# EAGLE design Hand (EAGLE 7.2.0)
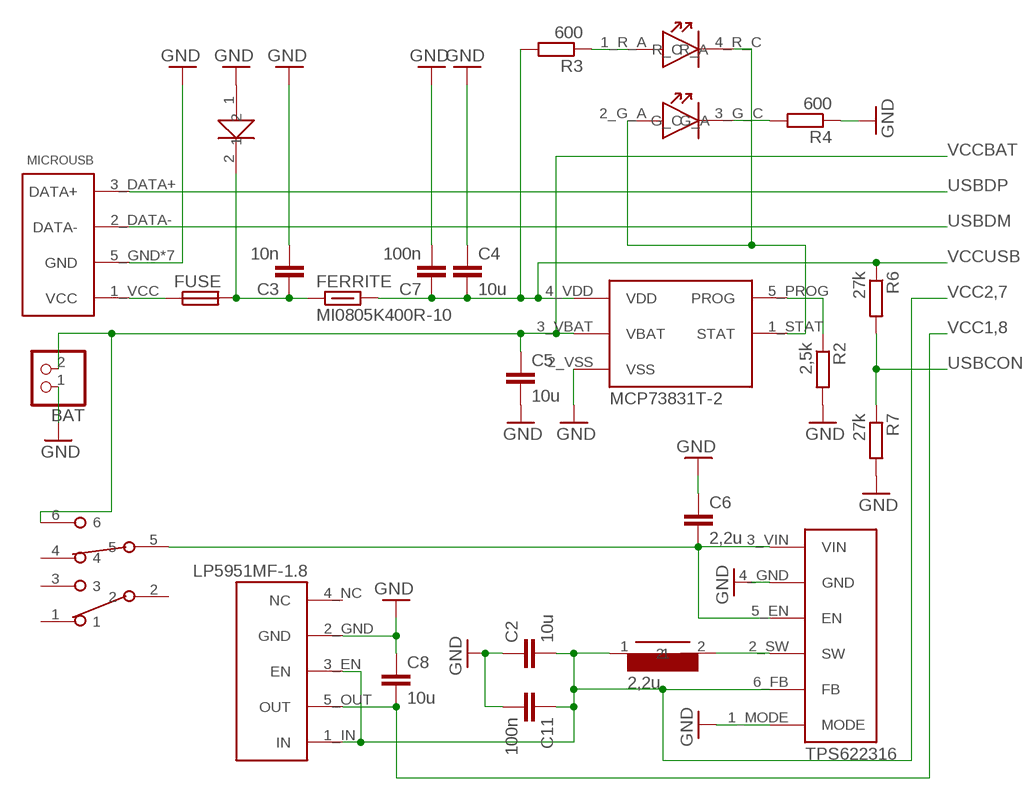
[diagram p0: schematic, sheet 1, part 1 of 2]
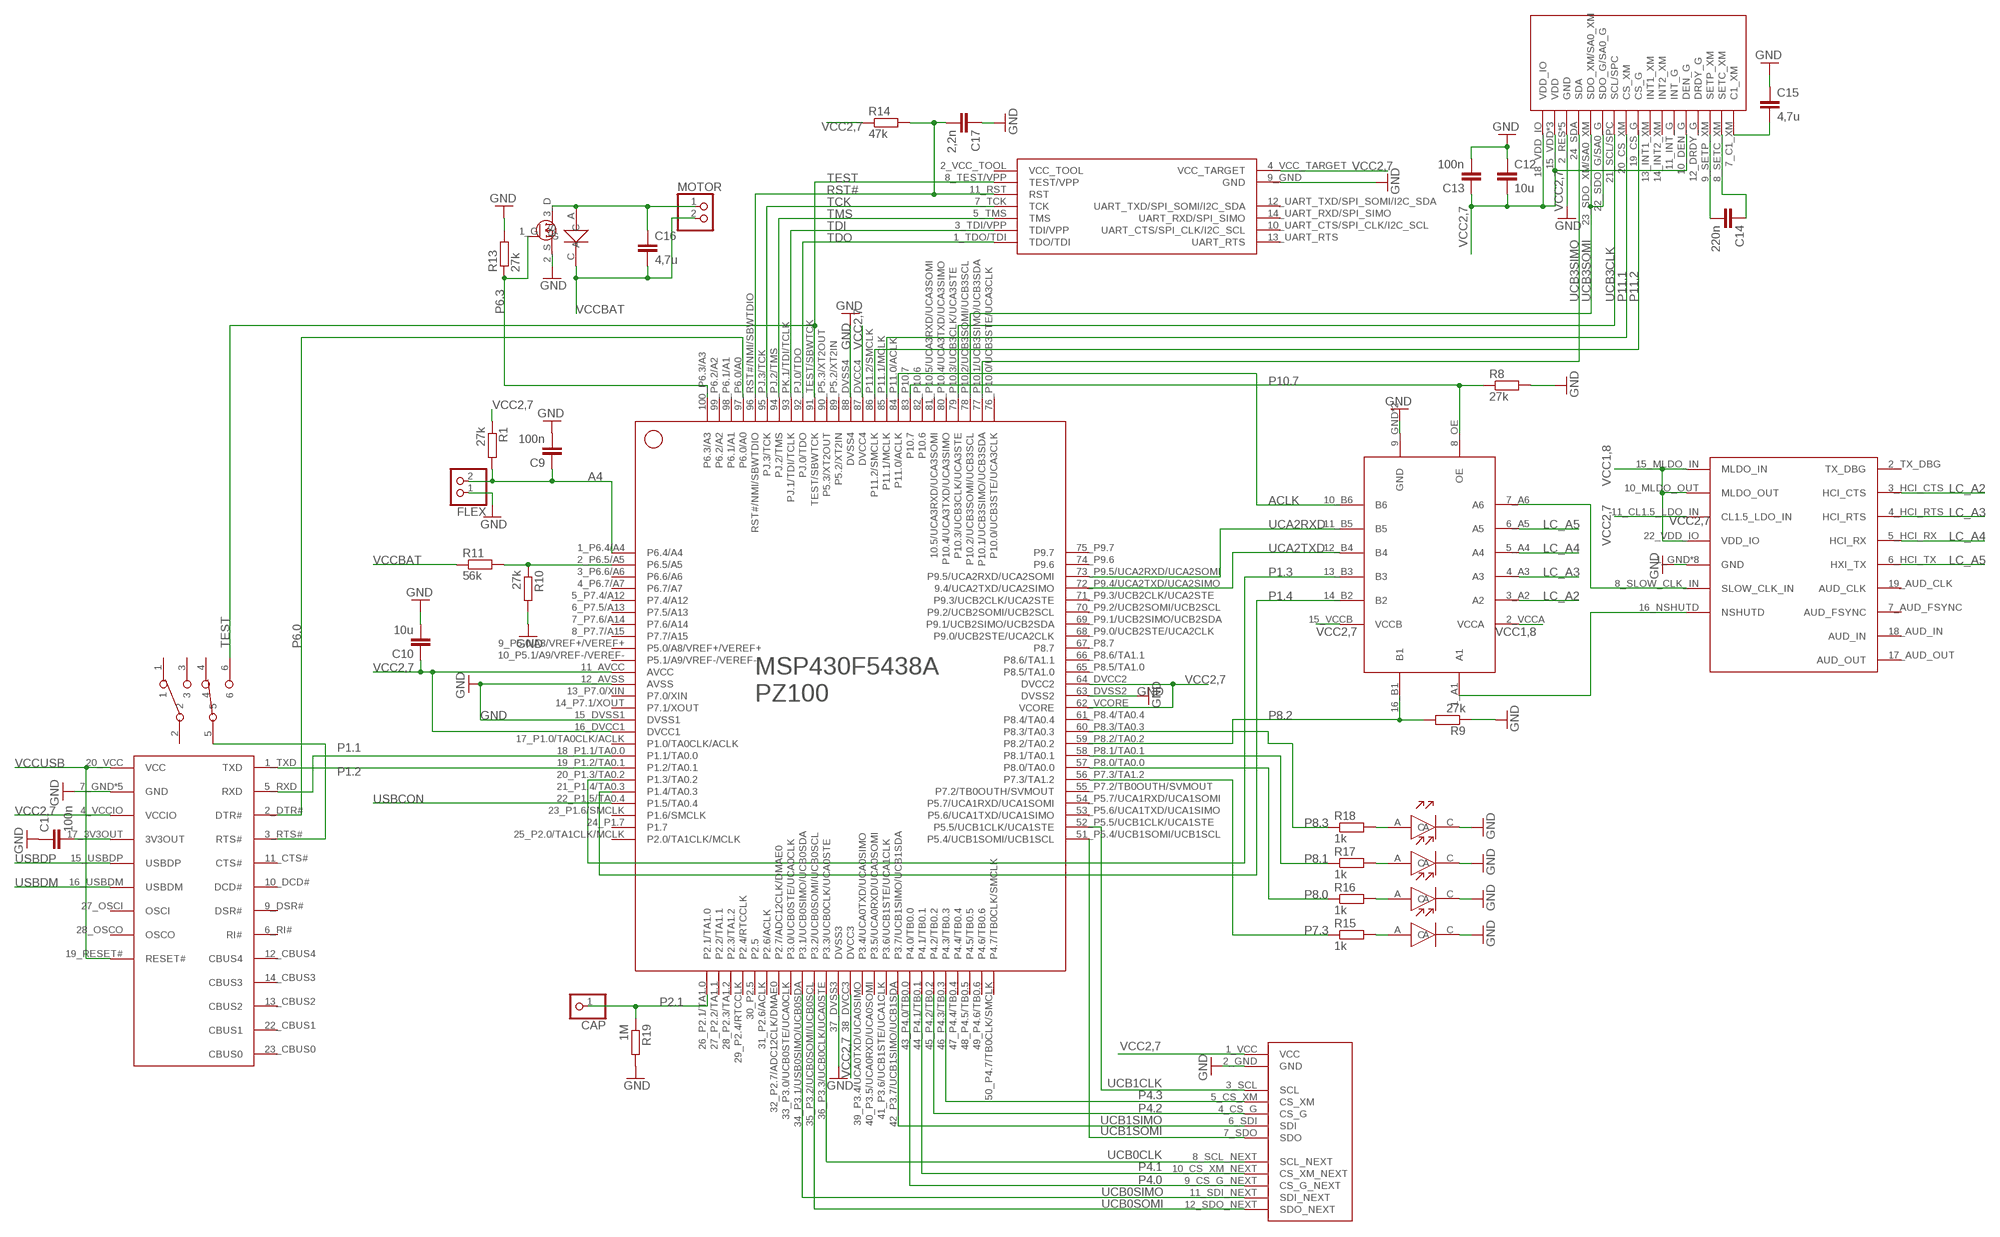
[diagram p1: schematic, sheet 1, part 2 of 2]

## Parts
BAT  PINHD-1X2  [1X02]
C1  100n  C-EUC0402  [C0402]
C2  10u  C-EUC0805  [C0805]
C3  10n  C-EUC0402  [C0402]
C4  10u  C-EUC0805  [C0805]
C5  10u  C-EUC0805  [C0805]
C6  2,2u  C-EUC0805  [C0805]
C7  100n  C-EUC0402  [C0402]
C8  10u  C-EUC0805  [C0805]
C9  100n  C-EUC0402  [C0402]
C10  10u  C-EUC0805  [C0805]
C11  100n  C-EUC0402  [C0402]
C12  10u  C-EUC0805  [C0805]
C13  100n  C-EUC0402  [C0402]
C14  220n  C-EUC0402  [C0402]
C15  4,7u  C-EUC0805  [C0805]
C16  4,7u  C-EUC0805  [C0805]
C17  2,2n  C-EUC0603  [C0603]
CAP  PINHD-1X1  [1X01]
FERRITE  MI0805K400R-10  FERRITER0603  [R0603]
FLEX  PINHD-1X2  [1X02]
FUSE  SICHERUNG  [C0603]
IMU_OUT  IMU-BUCHSE-OUT  [OUT]
LP5951MF-1.8  VDDIOREGLER-SC70  [SC70]
MCP73831T-2  MCP73831/2-SOT-23-5  [SOT-23-5]
MICROUSB  MICRO_USB-PCB  [PCB]
MOTOR  PINHD-1X2  [1X02]
R1  27k  R-EU_R0402  [R0402]
R2  2,5k  R-EU_R0402  [R0402]
R3  600  R-EU_R0402  [R0402]
R4  600  R-EU_R0402  [R0402]
R6  27k  R-EU_R0402  [R0402]
R7  27k  R-EU_R0402  [R0402]
R8  27k  R-EU_R0402  [R0402]
R9  27k  R-EU_R0402  [R0402]
R10  27k  R-EU_R0402  [R0402]
R11  56k  R-EU_R0402  [R0402]
R13  27k  R-EU_R0402  [R0402]
R14  47k  R-EU_R0402  [R0402]
R15  1k  R-EU_R0402  [R0402]
R16  1k  R-EU_R0402  [R0402]
R17  1k  R-EU_R0402  [R0402]
R18  1k  R-EU_R0402  [R0402]
R19  1M  R-EU_R0402  [R0402]
SPULE  2,2u  SPULE  [C0603]
TPS622316  SCHALTREGLER-R-PUSON-N6  [R-PUSON-N6]
U$1  FT232R-SSOP-28  [SSOP-28]
U$2  LSM9DS0-LGA-24  [LGA-24]
U$4  PAN132X  [BOARD]
U$5  MSP430BT5190-PZ100  [PZ100]
U$7  LED-PCB  [PCB]
U$8  LADE-MOSFET-SOC-23  [SOT-23]
U$9  FREILAUFDIODE  [FEILAUFDIODE]
U$11  ANSCHALTER-PACKAGE  [PACKAGE]
U$12  ANSCHALTER-PACKAGE  [PACKAGE]
U$13  LOGIKPEGELWANDLER-6CH  [R-PVQFN-N16]
U$15  LEDMINI  [LEDMINI]
U$16  JTAG-BUCHSE  [BUCHSE]
U$17  LEDMINI  [LEDMINI]
U$18  LEDMINI  [LEDMINI]
U$19  LEDMINI  [LEDMINI]
U$20  DIODE-C0603  [C0603]

## Nets
A4: C9.1 FLEX.2 R1.2 U$5.1_P6.4/A4(P6.4/A4)
ACLK: U$5.84_P11.0/ACLK(P11.0/ACLK) U$13.10_B6(B6)
GND: BAT.1 C1.1 C2.1 C3.2 C4.1 C5.2 C6.1 C7.2 C8.1 C9.2 C10.2 C11.2 C12.1 C13.2 C15.1 C17.1 FLEX.1 IMU_OUT.2_GND(GND) LP5951MF-1.8.2_GND(GND) MCP73831T-2.2_VSS(VSS) MICROUSB.5_GND(GND) MICROUSB.EP_1(GND) MICROUSB.EP_2(GND) MICROUSB.EP_3(GND) MICROUSB.EP_4(GND) MICROUSB.P$1(GND) MICROUSB.P$2(GND) R2.2 R4.1 R7.2 R8.2 R9.1 R10.2 R13.2 R19.2 TPS622316.1_MODE(MODE) TPS622316.4_GND(GND) U$1.7_GND(GND) U$1.18_GND(GND) U$1.21_GND(GND) U$1.25_AGND(GND) U$1.26_TEST(GND) U$2.2_RES(GND) U$2.3_RES(GND) U$2.4_RES(GND) U$2.5_GND(GND) U$2.6_GND(GND) U$4.1_GND(GND) U$4.12_GND(GND) U$4.14_GND(GND) U$4.20_GND(GND) U$4.A_GND(GND) U$4.B_GND(GND) U$4.C_GND(GND) U$4.D_GND(GND) U$5.12_AVSS(AVSS) U$5.15_DVSS1(DVSS1) U$5.37_DVSS3(DVSS3) U$5.63_DVSS2(DVSS2) U$5.88_DVSS4(DVSS4) U$8.2_S(S) U$13.9_GND(GND) U$13.PAD(GND) U$15.C U$16.9_GND(GND) U$17.C U$18.C U$19.C U$20.1
LC_A2: U$4.3_HCI_CTS(HCI_CTS) U$13.3_A2(A2)
LC_A3: U$4.4_HCI_RTS(HCI_RTS) U$13.4_A3(A3)
LC_A4: U$4.5_HCI_RX(HCI_RX) U$13.5_A4(A4)
LC_A5: U$4.6_HCI_TX(HXI_TX) U$13.6_A5(A5)
N$1: U$1.3_RTS#(RTS#) U$11.5
N$2: C3.1 FERRITE.1 FUSE.2 U$20.2
N$3: C1.2 U$1.17_3V3OUT(3V3OUT)
N$4: R10.1 R11.2 U$5.2_P6.5/A5(P6.5/A5)
N$5: MCP73831T-2.5_PROG(PROG) R2.1
N$6: R3.1 U$7.1_R_A(R_A)
N$7: MCP73831T-2.1_STAT(STAT) U$7.2_G_A(G_A) U$7.4_R_C(R_C)
N$8: U$4.8_SLOW_CLK_IN(SLOW_CLK_IN) U$13.7_A6(A6)
N$9: R4.2 U$7.3_G_C(G_C)
N$10: SPULE.2 TPS622316.2_SW(SW)
N$19: C6.2 TPS622316.3_VIN(VIN) TPS622316.5_EN(EN) U$12.5
N$25: U$4.16_NSHUTD(NSHUTD) U$13.1_A1(A1)
N$37: C16.1 MOTOR.1 U$8.3_D(D) U$9.A
N$40: R18.2 U$15.A
N$46: C15.2 U$2.7_C1_XM(C1_XM)
N$47: C14.1 U$2.8_SETC_XM(SETC_XM)
N$48: C14.2 U$2.9_SETP_XM(SETP_XM)
N$50: R17.2 U$17.A
N$52: R16.2 U$18.A
N$53: R15.2 U$19.A
N$60: FUSE.1 MICROUSB.1_VCC(VCC)
P1.1: U$1.5_RXD(RXD) U$5.18_P1.1/TA0.0(P1.1/TA0.0)
P1.2: U$1.1_TXD(TXD) U$5.19_P1.2/TA0.1(P1.2/TA0.1)
P1.3: U$5.20_P1.3/TA0.2(P1.3/TA0.2) U$13.13_B3(B3)
P1.4: U$5.21_P1.4/TA0.3(P1.4/TA0.3) U$13.14_B2(B2)
P2.1: CAP.1 R19.1 U$5.26_P2.1/TA1.0(P2.1/TA1.0)
P4.0: IMU_OUT.9_CS_G_NEXT(CS_G_NEXT) U$5.43_P4.0/TB0.0(P4.0/TB0.0)
P4.1: IMU_OUT.10_CS_XM_NEXT(CS_XM_NEXT) U$5.44_P4.1/TB0.1(P4.1/TB0.1)
P4.2: IMU_OUT.4_CS_G(CS_G) U$5.45_P4.2/TB0.2(P4.2/TB0.2)
P4.3: IMU_OUT.5_CS_XM(CS_XM) U$5.46_P4.3/TB0.3(P4.3/TB0.3)
P6.0: U$1.2_DTR#(DTR#) U$5.97_P6.0/A0(P6.0/A0)
P6.3: R13.1 U$5.100_P6.3/A3(P6.3/A3) U$8.1_G(G)
P7.3: R15.1 U$5.56_P7.3/TA1.2(P7.3/TA1.2)
P8.0: R16.1 U$5.57_P8.0/TA0.0(P8.0/TA0.0)
P8.1: R17.1 U$5.58_P8.1/TA0.1(P8.1/TA0.1)
P8.2: R9.2 U$5.59_P8.2/TA0.2(P8.2/TA0.2) U$13.16_B1(B1)
P8.3: R18.1 U$5.60_P8.3/TA0.3(P8.3/TA0.3)
P10.7: R8.1 U$5.83_P10.7(P10.7) U$13.8_OE(OE)
P11.1: U$2.20_CS_XM(CS_XM) U$5.85_P11.1/MCLK(P11.1/MCLK)
P11.2: U$2.19_CS_G(CS_G) U$5.86_P11.2/SMCLK(P11.2/SMCLK)
RST#: C17.2 R14.2 U$5.96_RST#/NMI/SBWTDIO(RST#/NMI/SBWTDIO) U$16.11_RST(RST)
TCK: U$5.95_PJ.3/TCK(PJ.3/TCK) U$16.7_TCK(TCK)
TDI: U$5.93_PK.1/TDI/TCLK(PJ.1/TDI/TCLK) U$16.3_TDI/VPP(TDI/VPP)
TDO: U$5.92_PJ.0/TDO(PJ.0/TDO) U$16.1_TDO/TDI(TDO/TDI)
TEST: U$5.91_TEST/SBWTCK(TEST/SBWTCK) U$11.6 U$16.8_TEST/VPP(TEST/VPP)
TMS: U$5.94_PJ.2/TMS(PJ.2/TMS) U$16.5_TMS(TMS)
UCA2RXD: U$5.73_P9.5/UCA2RXD/UCA2SOMI(P9.5/UCA2RXD/UCA2SOMI) U$13.11_B5(B5)
UCA2TXD: U$5.72_P9.4/UCA2TXD/UCA2SIMO(9.4/UCA2TXD/UCA2SIMO) U$13.12_B4(B4)
UCB0CLK: IMU_OUT.8_SCL_NEXT(SCL_NEXT) U$5.36_P3.3/UCB0CLK/UCA0STE(P3.3/UCB0CLK/UCA0STE)
UCB0SIMO: IMU_OUT.11_SDI_NEXT(SDI_NEXT) U$5.34_P3.1/USB0SIMO/UCB0SDA(P3.1/UCB0SIMO/UCB0SDA)
UCB0SOMI: IMU_OUT.12_SDO_NEXT(SDO_NEXT) U$5.35_P3.2/UCB0SOMI/UCB0SCL(P3.2/UCB0SOMI/UCB0SCL)
UCB1CLK: IMU_OUT.3_SCL(SCL) U$5.52_P5.5/UCB1CLK/UCA1STE(P5.5/UCB1CLK/UCA1STE)
UCB1SIMO: IMU_OUT.6_SDI(SDI) U$5.42_P3.7/UCB1SIMO/UCB1SDA(P3.7/UCB1SIMO/UCB1SDA)
UCB1SOMI: IMU_OUT.7_SDO(SDO) U$5.51_P5.4/UCB1SOMI/UCB1SCL(P5.4/UCB1SOMI/UCB1SCL)
UCB3CLK: U$2.21_SCL/SPC(SCL/SPC) U$5.79_P10.3/UCB3CLK/UCA3STE(P10.3/UCB3CLK/UCA3STE)
UCB3SIMO: U$2.24_SDA(SDA) U$5.77_P10.1/UCB3SIMO/UCB3SDA(P10.1/UCB3SIMO/UCB3SDA)
UCB3SOMI: U$2.22_SDO_G/SA0_G(SDO_G/SA0_G) U$2.23_SDO_XM/SA0_XM(SDO_XM/SA0_XM) U$5.78_P10.2/UCB3SOMI/UCB3SCL(P10.2/UCB3SOMI/UCB3SCL)
USBCON: R6.2 R7.1 U$5.22_P1.5/TA0.4(P1.5/TA0.4)
USBDM: MICROUSB.2_DATA-(DATA-) U$1.16_USBDM(USBDM)
USBDP: MICROUSB.3_DATA+(DATA+) U$1.15_USBDP(USBDP)
VCC1,8: C8.2 LP5951MF-1.8.5_OUT(OUT) U$4.10_MLDO_OUT(MLDO_OUT) U$4.15_MLDO_IN(MLDO_IN) U$4.22_VDD_IO(VDD_IO) U$13.2_VCCA(VCCA)
VCC2,7: C2.2 C10.1 C11.1 C12.2 C13.1 IMU_OUT.1_VCC(VCC) LP5951MF-1.8.1_IN(IN) LP5951MF-1.8.3_EN(EN) R1.1 R14.1 SPULE.1 TPS622316.6_FB(FB) U$1.4_VCCIO(VCCIO) U$2.10_DEN_G(DEN_G) U$2.15_VDD(VDD) U$2.16_VDD(VDD) U$2.17_VDD(VDD) U$2.18_VDD_IO(VDD_IO) U$4.11_CL1.5_LDO_IN(CL1.5_LDO_IN) U$5.11_AVCC(AVCC) U$5.16_DVCC1(DVCC1) U$5.38_DVCC3(DVCC3) U$5.62_VCORE(VCORE) U$5.64_DVCC2(DVCC2) U$5.87_DVCC4(DVCC4) U$13.15_VCCB(VCCB) U$16.4_VCC_TARGET(VCC_TARGET)
VCCBAT: BAT.2 C5.1 C16.2 MCP73831T-2.3_VBAT(VBAT) MOTOR.2 R11.1 U$9.C U$12.6
VCCUSB: C4.2 C7.1 FERRITE.2 MCP73831T-2.4_VDD(VDD) R3.2 R6.1 U$1.19_RESET#(RESET#) U$1.20_VCC(VCC)
Unconnected: LP5951MF-1.8.4_NC(NC) U$1.6_RI#(RI#) U$1.9_DSR#(DSR#) U$1.10_DCD#(DCD#) U$1.11_CTS#(CTS#) U$1.12_CBUS4(CBUS4) U$1.13_CBUS2(CBUS2) U$1.14_CBUS3(CBUS3) U$1.22_CBUS1(CBUS1) U$1.23_CBUS0(CBUS0) U$1.27_OSCI(OSCI) U$1.28_OSCO(OSCO) U$2.11_INT_G(INT_G) U$2.12_DRDY_G(DRDY_G) U$2.13_INT1_XM(INT1_XM) U$2.14_INT2_XM(INT2_XM) U$4.2_TX_DBG(TX_DBG) U$4.7_AUD_FSYNC(AUD_FSYNC) U$4.17_AUD_OUT(AUD_OUT) U$4.18_AUD_IN(AUD_IN) U$4.19_AUD_CLK(AUD_CLK) U$5.3_P6.6/A6(P6.6/A6) U$5.4_P6.7/A7(P6.7/A7) U$5.5_P7.4/A12(P7.4/A12) U$5.6_P7.5/A13(P7.5/A13) U$5.7_P7.6/A14(P7.6/A14) U$5.8_P7.7/A15(P7.7/A15) U$5.9_P5.0/A8/VREF+/VEREF+(P5.0/A8/VREF+/VEREF+) U$5.10_P5.1/A9/VREF-/VEREF-(P5.1/A9/VREF-/VEREF-) U$5.13_P7.0/XIN(P7.0/XIN) U$5.14_P7.1/XOUT(P7.1/XOUT) U$5.17_P1.0/TA0CLK/ACLK(P1.0/TA0CLK/ACLK) U$5.23_P1.6/SMCLK(P1.6/SMCLK) U$5.24_P1.7(P1.7) U$5.25_P2.0/TA1CLK/MCLK(P2.0/TA1CLK/MCLK) U$5.27_P2.2/TA1.1(P2.2/TA1.1) U$5.28_P2.3/TA1.2(P2.3/TA1.2) U$5.29_P2.4/RTCCLK(P2.4/RTCCLK) U$5.30_P2.5(P2.5) U$5.31_P2.6/ACLK(P2.6/ACLK) U$5.32_P2.7/ADC12CLK/DMAE0(P2.7/ADC12CLK/DMAE0) U$5.33_P3.0/UCB0STE/UCA0CLK(P3.0/UCB0STE/UCA0CLK) U$5.39_P3.4/UCA0TXD/UCA0SIMO(P3.4/UCA0TXD/UCA0SIMO) U$5.40_P3.5/UCA0RXD/UCA0SOMI(P3.5/UCA0RXD/UCA0SOMI) U$5.41_P3.6/UCB1STE/UCA1CLK(P3.6/UCB1STE/UCA1CLK) U$5.47_P4.4/TB0.4(P4.4/TB0.4) U$5.48_P4.5/TB0.5(P4.5/TB0.5) U$5.49_P4.6/TB0.6(P4.6/TB0.6) U$5.50_P4.7/TB0CLK/SMCLK(P4.7/TB0CLK/SMCLK) U$5.53_P5.6/UCA1TXD/UCA1SIMO(P5.6/UCA1TXD/UCA1SIMO) U$5.54_P5.7/UCA1RXD/UCA1SOMI(P5.7/UCA1RXD/UCA1SOMI) U$5.55_P7.2/TB0OUTH/SVMOUT(P7.2/TB0OUTH/SVMOUT) U$5.61_P8.4/TA0.4(P8.4/TA0.4) U$5.65_P8.5/TA1.0(P8.5/TA1.0) U$5.66_P8.6/TA1.1(P8.6/TA1.1) U$5.67_P8.7(P8.7) U$5.68_P9.0/UCB2STE/UCA2CLK(P9.0/UCB2STE/UCA2CLK) U$5.69_P9.1/UCB2SIMO/UCB2SDA(P9.1/UCB2SIMO/UCB2SDA) U$5.70_P9.2/UCB2SOMI/UCB2SCL(P9.2/UCB2SOMI/UCB2SCL) U$5.71_P9.3/UCB2CLK/UCA2STE(P9.3/UCB2CLK/UCA2STE) U$5.74_P9.6(P9.6) U$5.75_P9.7(P9.7) U$5.76_P10.0/UCB3STE/UCA3CLK(P10.0/UCB3STE/UCA3CLK) U$5.80_P10.4/UCA3TXD/UCA3SIMO(P10.4/UCA3TXD/UCA3SIMO) U$5.81_P10.5/UCA3RXD/UCA3SOMI(10.5/UCA3RXD/UCA3SOMI) U$5.82_P10.6(P10.6) U$5.89_P5.2/XT2IN(P5.2/XT2IN) U$5.90_P5.3/XT2OUT(P5.3/XT2OUT) U$5.98_P6.1/A1(P6.1/A1) U$5.99_P6.2/A2(P6.2/A2) U$11.1 U$11.2 U$11.3 U$11.4 U$12.1 U$12.2 U$12.3 U$12.4 U$16.2_VCC_TOOL(VCC_TOOL) U$16.10_UART_CTS/SPI_CLK/I2C_SCL(UART_CTS/SPI_CLK/I2C_SCL) U$16.12_UART_TXD/SPI_SOMI/I2C_SDA(UART_TXD/SPI_SOMI/I2C_SDA) U$16.13_UART_RTS(UART_RTS) U$16.14_UART_RXD/SPI_SIMO(UART_RXD/SPI_SIMO)

## Library data of the parts
BAT FLEX MOTOR = pinheadGlove:PINHD-1X2: PIN HEADER
C1 C3 C7 C9 C11 C13 C14 C17 = rclGlove:C-EU: CAPACITOR, European symbol
C2 C4-C6 C8 C10 C12 C15 C16 = rcl:C-EU: CAPACITOR, European symbol
CAP = pinhead:PINHD-1X1: PIN HEADER
FERRITE = Ferrit:FERRITE: RESISTOR, European symbol
FUSE = Sicherung:SICHERUNG
IMU_OUT = IMU-Buchse:IMU-BUCHSE-OUT
LP5951MF-1.8 = TI VddIoRegler:VDDIOREGLER-SC70
MCP73831T-2 = Microchip MCP73831_2:MCP73831/2-SOT-23-5
MICROUSB = Micro USB:MICRO_USB-PCB
R1-R4 R6-R11 R13-R19 = rclGlove:R-EU_: RESISTOR, European symbol
SPULE = Spule:SPULE
TPS622316 = TI Schaltregler:SCHALTREGLER-R-PUSON-N6
U$1 = FTDI FT232R:FT232R-SSOP-28
U$2 = ST LSM9DS0TR:LSM9DS0-LGA-24
U$4 = Panasonic PAN132X:PAN132X
U$5 = TI MSP430BT5190:MSP430BT5190-PZ100: ***MSP430F54xx***PZ100
U$7 = LED:LED-PCB
U$8 = Lade-MOSFET:LADE-MOSFET-SOC-23
U$9 = Freilaufdiode:FREILAUFDIODE
U$11 U$12 = Anschalter:ANSCHALTER-PACKAGE
U$13 = TI Logikpegelwandler:LOGIKPEGELWANDLER-6CH
U$15 U$17-U$19 = led2ma:LEDMINI
U$16 = JTAG:JTAG-BUCHSE
U$20 = Diode-USB:DIODE-C0603

## Board
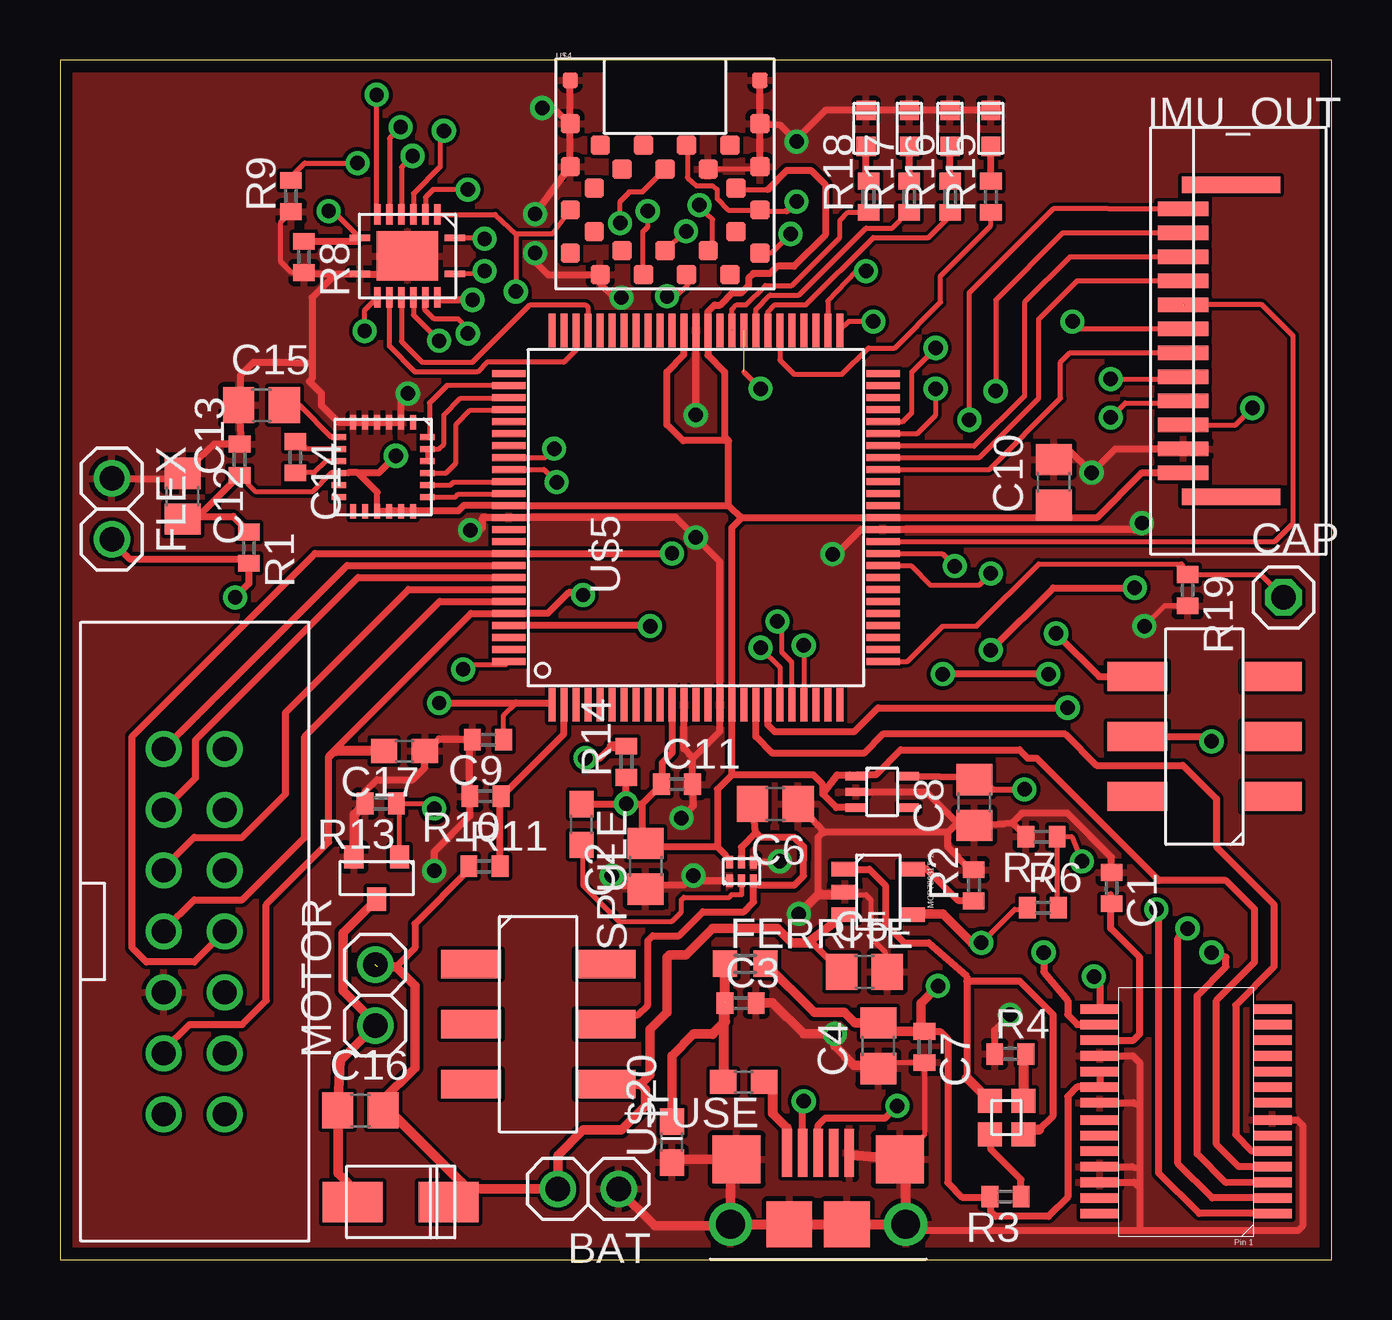
[diagram p2: board, top side]
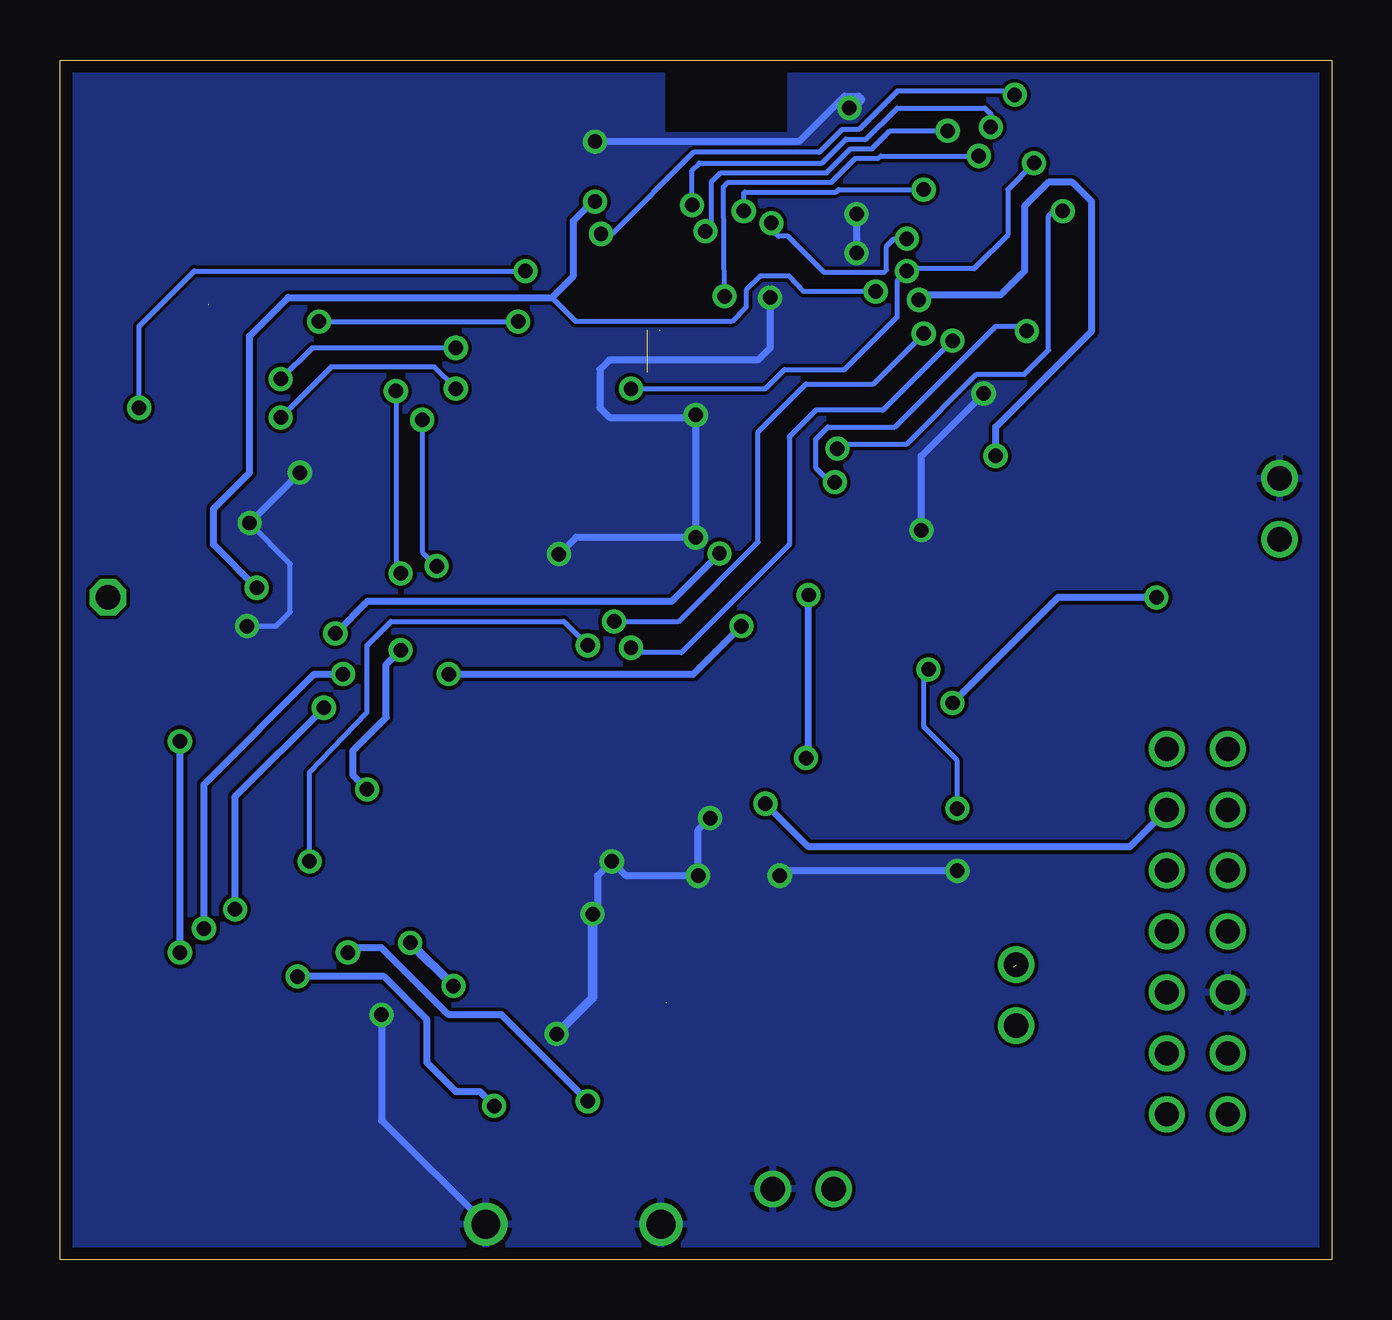
[diagram p3: board, bottom side, seen from below]

Size 53 x 50 mm. Coordinates in mm from the lower left corner, seen from the top.
Outline: 0,0 53,0 53,50 0,50 0,0
Copper layers (1*16): Top 0.035mm / dielectric 1.5mm / Bottom 0.035mm
Design rules "default *": minimum track width 6mil, minimum drill 0.6mm, track to track 6mil, track to pad 6mil, pad to pad 6mil, via to via 6mil, smd to smd 6mil, copper to edge 20mil, drill to drill 8mil, minimum pad ring 6mil, minimum via ring 8mil, stop-mask expansion 4mil, vias tented up to drill 0mil, thermal gap 8mil

### Footprints (pad centres in the part's own frame; a part is rotated, then mirrored left to right if it is on the bottom)
1X02 = drill 1.016: 1 -1.27,0; 2 1.27,0
C0402 = smd 0.7 x 0.9: 1 -0.65,0; 2 0.65,0
C0805 = smd 1.3 x 1.5: 1 -0.95,0; 2 0.95,0
C0603 = smd 1.1 x 1: 1 -0.85,0; 2 0.85,0
1X01 = drill 1.016 octagon: 1 0,0
R0603 = smd 1 x 1.1: 1 -0.85,0; 2 0.85,0
OUT = smd 2.1 x 0.6: 1_VCC -2.3,-5.5; 2_GND -2.3,-4.5; 3_SCL -2.3,-3.5; 4_CS_G -2.3,-2.5; 5_CS_XM -2.3,-1.5; 6_SDI -2.3,-0.5; 7_SDO -2.3,0.5; 8_SCL_NEXT -2.3,1.5; 9_CS_G_NEXT -2.3,2.5; 10_CS_XM_NEXT -2.3,3.5; 11_SDI_NEXT -2.3,4.5; 12_SDO_NEXT -2.3,5.5 | smd 4.1 x 0.7: 13_NC -0.3,6.5; 14_NC -0.3,-6.5
SC70 = smd 0.35 x 0.85: 1_IN -0.65,-1.1; 2_GND 0,-1.1; 3_EN 0.65,-1.1; 4_NC 0.65,1.1; 5_OUT -0.65,1.1
SOT-23-5 = smd 0.6 x 1.1: 1_STAT -0.95,-1.4; 2_VSS 0,-1.4; 3_VBAT 0.95,-1.4; 4_VDD 0.95,1.4; 5_PROG -0.95,1.4
PCB = smd 0.4 x 2: 1_VCC -1.3,2.97; 2_DATA- -0.65,2.97; 3_DATA+ 0,2.97; 4_NC 0.65,2.97; 5_GND 1.3,2.97 | smd 2 x 2: EP_1 -3.4,2.7; EP_2 3.4,2.7 | smd 1.9 x 1.9: EP_3 -1.2,0; EP_4 1.2,0 | drill 1.2 pad 1.6: P$1 -3.65,0; P$2 3.65,0
R0402 = smd 0.7 x 0.9: 1 -0.65,0; 2 0.65,0
R-PUSON-N6 = smd 0.3 x 0.52: 1_MODE -0.5,-0.39; 2_SW 0,-0.39; 3_VIN 0.5,-0.39; 4_GND 0.5,0.39; 5_EN 0,0.39; 6_FB -0.5,0.39
SSOP-28 = smd 1.6 x 0.4: 1_TXD -3.6,4.23; 2_DTR# -3.6,3.58; 3_RTS# -3.6,2.93; 4_VCCIO -3.6,2.28; 5_RXD -3.6,1.63; 6_RI# -3.6,0.98; 7_GND -3.6,0.33; 8_NC -3.6,-0.39; 9_DSR# -3.6,-1.04; 10_DCD# -3.6,-1.69; 11_CTS# -3.6,-2.34; 12_CBUS4 -3.6,-2.99; 13_CBUS2 -3.6,-3.64; 14_CBUS3 -3.6,-4.29; 15_USBDP 3.6,-4.29; 16_USBDM 3.6,-3.64; 17_3V3OUT 3.6,-2.99; 18_GND 3.6,-2.34; 19_RESET# 3.6,-1.69; 20_VCC 3.6,-1.04; 21_GND 3.6,-0.39; 22_CBUS1 3.6,0.33; 23_CBUS0 3.6,0.98; 24_NC 3.6,1.63; 25_AGND 3.6,2.28; 26_TEST 3.6,2.93; 27_OSCI 3.6,3.58; 28_OSCO 3.6,4.23
LGA-24 = smd 0.25 x 0.6: 1_RES -1.25,-1.85; 2_RES -0.75,-1.85; 3_RES -0.25,-1.85; 4_RES 0.25,-1.85; 5_GND 0.75,-1.85; 6_GND 1.25,-1.85; 13_INT1_XM 1.25,1.85; 14_INT2_XM 0.75,1.85; 15_VDD 0.25,1.85; 16_VDD -0.25,1.85; 17_VDD -0.75,1.85; 18_VDD_IO -1.25,1.85 | smd 0.6 x 0.25: 7_C1_XM 1.85,-1.25; 8_SETC_XM 1.85,-0.75; 9_SETP_XM 1.85,-0.25; 10_DEN_G 1.85,0.25; 11_INT_G 1.85,0.75; 12_DRDY_G 1.85,1.25; 19_CS_G -1.85,1.25; 20_CS_XM -1.85,0.75; 21_SCL/SPC -1.85,0.25; 22_SDO_G/SA0_G -1.85,-0.25; 23_SDO_XM/SA0_XM -1.85,-0.75; 24_SDA -1.85,-1.25
BOARD = smd 0.8 x 0.8: 1_GND -2.7,-4.2; 2_TX_DBG -1.8,-3.2; 3_HCI_CTS -0.9,-4.2; 4_HCI_RTS 0,-3.2; 5_HCI_RX 0.9,-4.2; 6_HCI_TX 1.8,-3.2; 7_AUD_FSYNC 2.7,-4.2; 8_SLOW_CLK_IN 3.95,-3.3; 9_NC 2.95,-2.4; 10_MLDO_OUT 3.95,-1.5; 11_CL1.5_LDO_IN 2.95,-0.6; 12_GND 3.95,0.3; 13_NC 2.7,1.2; 14_GND 1.8,0.2; 15_MLDO_IN 0.9,1.2; 16_NSHUTD 0,0.2; 17_AUD_OUT -0.9,1.2; 18_AUD_IN -1.8,0.2; 19_AUD_CLK -2.7,1.2; 20_GND -3.95,0.3; 21_NC -2.95,-0.6; 22_VDD_IO -3.95,-1.5; 23_NC -2.95,-2.4; 24_NC -3.95,-3.3; A_GND -3.95,2.1; B_GND 3.95,2.1 | smd 0.65 x 0.65: C_GND -3.95,3.9; D_GND 3.95,3.9
PZ100 = smd 1.4 x 0.3: 1_P6.4/A4 -7.8,6; 2_P6.5/A5 -7.8,5.5; 3_P6.6/A6 -7.8,5; 4_P6.7/A7 -7.8,4.5; 5_P7.4/A12 -7.8,4; 6_P7.5/A13 -7.8,3.5; 7_P7.6/A14 -7.8,3; 8_P7.7/A15 -7.8,2.5; 9_P5.0/A8/VREF+/VEREF+ -7.8,2; 10_P5.1/A9/VREF-/VEREF- -7.8,1.5; 11_AVCC -7.8,1; 12_AVSS -7.8,0.5; 13_P7.0/XIN -7.8,0; 14_P7.1/XOUT -7.8,-0.5; 15_DVSS1 -7.8,-1; 16_DVCC1 -7.8,-1.5; 17_P1.0/TA0CLK/ACLK -7.8,-2; 18_P1.1/TA0.0 -7.8,-2.5; 19_P1.2/TA0.1 -7.8,-3; 20_P1.3/TA0.2 -7.8,-3.5; 21_P1.4/TA0.3 -7.8,-4; 22_P1.5/TA0.4 -7.8,-4.5; 23_P1.6/SMCLK -7.8,-5; 24_P1.7 -7.8,-5.5; 25_P2.0/TA1CLK/MCLK -7.8,-6; 51_P5.4/UCB1SOMI/UCB1SCL 7.8,-6; 52_P5.5/UCB1CLK/UCA1STE 7.8,-5.5; 53_P5.6/UCA1TXD/UCA1SIMO 7.8,-5; 54_P5.7/UCA1RXD/UCA1SOMI 7.8,-4.5; 55_P7.2/TB0OUTH/SVMOUT 7.8,-4; 56_P7.3/TA1.2 7.8,-3.5; 57_P8.0/TA0.0 7.8,-3; 58_P8.1/TA0.1 7.8,-2.5; 59_P8.2/TA0.2 7.8,-2; 60_P8.3/TA0.3 7.8,-1.5; 61_P8.4/TA0.4 7.8,-1; 62_VCORE 7.8,-0.5; 63_DVSS2 7.8,0; 64_DVCC2 7.8,0.5; 65_P8.5/TA1.0 7.8,1; 66_P8.6/TA1.1 7.8,1.5; 67_P8.7 7.8,2; 68_P9.0/UCB2STE/UCA2CLK 7.8,2.5; 69_P9.1/UCB2SIMO/UCB2SDA 7.8,3; 70_P9.2/UCB2SOMI/UCB2SCL 7.8,3.5; 71_P9.3/UCB2CLK/UCA2STE 7.8,4; 72_P9.4/UCA2TXD/UCA2SIMO 7.8,4.5; 73_P9.5/UCA2RXD/UCA2SOMI 7.8,5; 74_P9.6 7.8,5.5; 75_P9.7 7.8,6 | smd 0.3 x 1.4: 26_P2.1/TA1.0 -6,-7.8; 27_P2.2/TA1.1 -5.5,-7.8; 28_P2.3/TA1.2 -5,-7.8; 29_P2.4/RTCCLK -4.5,-7.8; 30_P2.5 -4,-7.8; 31_P2.6/ACLK -3.5,-7.8; 32_P2.7/ADC12CLK/DMAE0 -3,-7.8; 33_P3.0/UCB0STE/UCA0CLK -2.5,-7.8; 34_P3.1/USB0SIMO/UCB0SDA -2,-7.8; 35_P3.2/UCB0SOMI/UCB0SCL -1.5,-7.8; 36_P3.3/UCB0CLK/UCA0STE -1,-7.8; 37_DVSS3 -0.5,-7.8; 38_DVCC3 0,-7.8; 39_P3.4/UCA0TXD/UCA0SIMO 0.5,-7.8; 40_P3.5/UCA0RXD/UCA0SOMI 1,-7.8; 41_P3.6/UCB1STE/UCA1CLK 1.5,-7.8; 42_P3.7/UCB1SIMO/UCB1SDA 2,-7.8; 43_P4.0/TB0.0 2.5,-7.8; 44_P4.1/TB0.1 3,-7.8; 45_P4.2/TB0.2 3.5,-7.8; 46_P4.3/TB0.3 4,-7.8; 47_P4.4/TB0.4 4.5,-7.8; 48_P4.5/TB0.5 5,-7.8; 49_P4.6/TB0.6 5.5,-7.8; 50_P4.7/TB0CLK/SMCLK 6,-7.8; 76_P10.0/UCB3STE/UCA3CLK 6,7.8; 77_P10.1/UCB3SIMO/UCB3SDA 5.5,7.8; 78_P10.2/UCB3SOMI/UCB3SCL 5,7.8; 79_P10.3/UCB3CLK/UCA3STE 4.5,7.8; 80_P10.4/UCA3TXD/UCA3SIMO 4,7.8; 81_P10.5/UCA3RXD/UCA3SOMI 3.5,7.8; 82_P10.6 3,7.8; 83_P10.7 2.5,7.8; 84_P11.0/ACLK 2,7.8; 85_P11.1/MCLK 1.5,7.8; 86_P11.2/SMCLK 1,7.8; 87_DVCC4 0.5,7.8; 88_DVSS4 0,7.8; 89_P5.2/XT2IN -0.5,7.8; 90_P5.3/XT2OUT -1,7.8; 91_TEST/SBWTCK -1.5,7.8; 92_PJ.0/TDO -2,7.8; 93_PK.1/TDI/TCLK -2.5,7.8; 94_PJ.2/TMS -3,7.8; 95_PJ.3/TCK -3.5,7.8; 96_RST#/NMI/SBWTDIO -4,7.8; 97_P6.0/A0 -4.5,7.8; 98_P6.1/A1 -5,7.8; 99_P6.2/A2 -5.5,7.8; 100_P6.3/A3 -6,7.8
PCB' = smd 1 x 1: 1_R_A 0.7,0.7; 2_G_A 0.7,-0.7; 3_G_C -0.7,-0.7; 4_R_C -0.7,0.7
SOT-23 = smd 0.8 x 0.97: 1_G -0.95,-0.88; 2_S 0.95,-0.88; 3_D 0,0.88
FEILAUFDIODE = smd 2.5 x 1.7: A -2,0; C 2,0
PACKAGE = smd 1.2 x 2.5: 1 -2.5,-2.8; 2 0,-2.8; 3 2.5,-2.8; 4 -2.5,2.8; 5 0,2.8; 6 2.5,2.8
R-PVQFN-N16 = smd 0.85 x 0.28: 1_A1 -1.975,-0.75; 8_OE 1.975,-0.75; 9_GND 1.975,0.75; 16_B1 -1.975,0.75 | smd 0.28 x 0.85: 2_VCCA -1.25,-1.725; 3_A2 -0.75,-1.725; 4_A3 -0.25,-1.725; 5_A4 0.25,-1.725; 6_A5 0.75,-1.725; 7_A6 1.25,-1.725; 10_B6 1.25,1.725; 11_B5 0.75,1.725; 12_B4 0.25,1.725; 13_B3 -0.25,1.725; 14_B2 -0.75,1.725; 15_VCCB -1.25,1.725 | smd 2.55 x 2.05: PAD 0,0
LEDMINI = smd 0.8 x 0.8: A 0,0; C 1.5,0
BUCHSE = drill 1: 1_TDO/TDI 7.62,2.54; 2_VCC_TOOL 7.62,0; 3_TDI/VPP 5.08,2.54; 4_VCC_TARGET 5.08,0; 5_TMS 2.54,2.54; 6_NC 2.54,0; 7_TCK 0,2.54; 8_TEST/VPP 0,0; 9_GND -2.54,2.54; 10_UART_CTS/SPI_CLK/I2C_SCL -2.54,0; 11_RST -5.08,2.54; 12_UART_TXD/SPI_SOMI/I2C_SDA -5.08,0; 13_UART_RTS -7.62,2.54; 14_UART_RXD/SPI_SIMO -7.62,0

### Placement (x,y rotation side)
BAT  22.02,2.94 180 top
C1  43.83,15.48 270 top
C2  24.41,16.39 90 top
C3  28.37,10.69 0 top
C4  34.11,8.91 90 top
C5  33.53,11.99 0 top
C6  29.82,18.99 180 top
C7  36.03,8.86 270 top
C8  38.11,19.05 90 top
C9  17.84,21.67 180 top
C10  41.42,32.4 90 top
C11  25.72,19.81 0 top
C12  5.11,31.82 270 top
C13  7.49,33.34 90 top
C14  9.81,33.44 270 top
C15  8.4,35.61 0 top
C16  12.52,6.21 0 top
C17  14.36,21.19 180 top
CAP  51,27.6 0 top
FERRITE  28.56,12.33 0 top
FLEX  2.16,31.29 270 top
FUSE  28.5,7.4 180 top
IMU_OUT  49.12,38.29 0 top
LP5951MF-1.8  34.27,19.49 270 top
MCP73831T-2  34.11,15.32 270 top
MICROUSB  31.6,1.47 0 top
MOTOR  13.14,11.02 90 top
R1  7.87,29.67 270 top
R2  38.09,15.6 90 top
R3  39.41,2.63 180 top
R4  39.61,8.57 0 top
R6  40.97,14.67 0 top
R7  40.91,17.63 180 top
R8  10.17,41.79 270 top
R9  9.63,44.33 90 top
R10  17.73,19.31 180 top
R11  17.69,16.39 0 top
R13  13.37,19.01 180 top
R14  23.61,20.75 90 top
R15  38.8,44.3 90 top
R16  37.1,44.3 90 top
R17  35.4,44.3 90 top
R18  33.7,44.3 90 top
R19  47,27.9 270 top
SPULE  21.73,18.13 270 top
TPS622316  28.41,16.18 0 top
U$1  46.94,6.15 180 top
U$2  13.47,33.04 180 top
U$4  25.22,45.25 0 top
U$5  26.51,30.93 90 top
U$7  LED-PCB  [PCB']  39.45,5.92 180 top
U$8  13.2,15.9 180 top
U$9  14.2,2.4 0 top
U$11  47.7,21.8 90 top
U$12  19.93,9.81 270 top
U$13  14.48,41.83 180 top
U$15  33.6,46.4 90 top
U$16  6.87,13.67 90 top
U$17  35.4,46.4 90 top
U$18  37.1,46.4 90 top
U$19  38.8,46.4 90 top
U$20  25.5,4.9 90 top

### Tracks (layer width: path | path; a pad name or v marks a point on that pad's centre or on a via)
A4  (via drill 0.6 pad 0.25)
  Top 0.2: C9.1 18.49,22.69 19,23.2
  Top 0.3: FLEX.2 2.16,29.94 2.9,29.2 7.69,29.2 R1.2 7.87,28.17 v7.3,27.6 | v15.8,23.2 19,23.2 20.44,23.2 U$5.1_P6.4/A4
  Bottom 0.3: v7.3,27.6 11.4,27.6 v15.8,23.2
ACLK  (via drill 0.6 pad 0.25)
  Top 0.2: U$5.84_P11.0/ACLK 20.17,32.93 v20.7,32.4 | v12.7,38.7 12.7,39.58 U$13.10_B6
  Bottom 0.2: v20.7,32.4 20.9,32.4 21.5,33 21.5,34.2 21,34.7 18.2,34.7 14,38.9 12.5,38.9 12.4,38.8 12.4,38.7 12.5,38.6 12.6,38.6 v12.7,38.7
GND  (via drill 0.6, 0.6 pad 0.25)
  Top 0.2: 35.78,7.96 C7.2 | C7.2 36.03,5.18 MICROUSB.EP_2 | 32.59,15.2 33.6,15.2 33.8,15 33.8,13.4 34.4,12.8 34.4,11.91 C5.2 | 14.2,34.91 U$2.2_RES | 7.6,35.66 C15.1 | 7.55,34.05 C13.2 | U$4.1_GND 22.52,40.68 | R8.2 9.66,41.14 9.2,41.6 9.2,43.25 R9.1 | R19.2 46.05,27.25 v45.2,26.4 | U$4.12_GND 29.07,45.45 U$4.14_GND | C4.1 34.36,8.21 C7.2
  Top 0.254: U$2.3_RES U$2.2_RES
  Top 0.3: R4.1 38.96,9.56 v39.6,10.2 | U$1.18_GND 44.71,8.49 45,8.2 45,6.4 | 45,6.4 45,3.8 | 45,3.8 45,3 | 45,3 45,1.2 | 45,1.2 35.7,1.2 MICROUSB.P$2 | U$1.21_GND 44.74,6.54 45,6.4 | U$1.25_AGND 44.67,3.87 45,3.8 | U$1.26_TEST 44.78,3.22 45,3 | U$1.7_GND 51.58,5.82 51.8,5.6 51.8,1.4 51.6,1.2 45,1.2 | LP5951MF-1.8.2_GND 36.11,19.49 37.4,18.2 | 39.69,18.2 C8.1 37.4,18.2 | 39.69,18.2 R7.2 | 37.4,18.2 37,17.8 | 37,17.8 31.86,17.8 | 31.86,17.8 C6.1 | 31.86,17.8 31.8,17.8 31.6,17.6 31.6,15.4 31.8,15.2 | TPS622316.4_GND 29.97,16.57 v30,16.6 | TPS622316.1_MODE 26.61,15.79 v26.4,16 26,15.6 24.47,15.6 C2.1 24.35,15.6 23.4,15.6 v23,16 | C1.1 43.83,16.77 42,18.6 40.09,18.6 39.69,18.2 | R2.2 37.95,16.25 37,17.2 37,17.8 | v14.5,36.1 14.2,35.8 14.2,34.91 | U$2.3_RES U$2.4_RES U$2.5_GND U$2.6_GND 11.61,34.89 10.9,35.6 10.9,36.1 10.4,36.6 10.5,36.7 10.5,37.39 | 7.6,35.66 7.6,36.2 7.53,36.27 7.53,36.86 8.06,37.39 8.11,37.39 8.12,37.4 9.74,37.4 9.75,37.39 10.5,37.39 | C15.1 7.55,34.05 | C13.2 6.43,33.99 C12.1 5,32.56 FLEX.1 | C11.2 26.37,20.87 27.51,22.01 U$5.15_DVSS1 27.51,29.09 v26.5,30.1 25.67,30.93 U$5.88_DVSS4 17.63,30.93 17.6,30.9 17.6,30.5 17.5,30.4 v17.1,30.4 | C11.2 26.37,20.93 26,21.3 26.01,21.31 U$5.12_AVSS | v25.9,18.4 26.4,18.9 26.4,19.78 C11.2 | U$4.A_GND U$4.20_GND v19.8,43.58 | U$4.A_GND U$4.C_GND | IMU_OUT.2_GND 43.99,33.79 v43,32.8 41.99,33.81 C10.2 | v45.1,30.7 44.8,30.4 44.77,30.43 U$5.37_DVSS3 33.39,30.43 32.35,29.39 v32.21,29.39 v32.2,29.4 | 11.48,41.08 U$13.9_GND 13.73,41.08 U$13.PAD | 11.48,41.08 10.5,40.1 10.5,37.39 | 11.48,41.08 10.23,41.08 R8.2 | R13.2 12.72,19.52 13.2,20 14.7,20 15.2,20.5 C17.1 15.29,21.19 15.8,21.7 17.16,21.7 C9.2 17.08,21.56 R10.2 17.08,18.48 15.6,17 v15.6,16.2
  Top 0.3: 22.52,40.68 23,40.2 23.3,40.2 v23.4,40.1 | U$4.B_GND 30,47.3 v30.7,46.6 30.7,46.7 31.9,47.9 U$15.C U$17.C U$18.C U$19.C | v20.1,48 20.57,48 21.22,47.35 U$4.A_GND | U$4.12_GND U$4.B_GND | U$4.B_GND U$4.D_GND | 27.12,45.5 U$4.14_GND | v26.5,35.2 v26.51,35.21 U$5.63_DVSS2 | U$4.1_GND 20.35,41.05 19.8,41.6 v19.8,41.95
  Top 0.4: 23.4,3 23.34,2.94 BAT.1 23.29,2.91 24.8,1.4 27.9,1.4 MICROUSB.P$1 27.95,3.92 MICROUSB.EP_1 25.62,4.17 U$20.1 | U$8.2_S 12.25,18.54 R13.2 | v30.8,14.4 31.6,15.2 31.8,15.2 32.59,15.2 MCP73831T-2.2_VSS | C4.1 33.97,8.1 33.1,8.1 32.3,8.9 v32.3,9.4 31,9.4 29.7,10.7 C3.2
  Top 0.406: MICROUSB.P$1 MICROUSB.EP_3 MICROUSB.EP_4 MICROUSB.P$2 35.25,3.9 MICROUSB.EP_2 32.97,4.35 MICROUSB.5_GND
  Bottom 0.2: 26.6,35.1 v26.5,35.2 | v45.2,26.4 44,26.4 43.4,27 43.4,29 v45.1,30.7
  Bottom 0.3: v39.6,10.2 39.6,5.8 MICROUSB.P$2 | v30.8,14.4 30.6,14.6 30.6,16 v30,16.6 29.4,16 v26.4,16 26.4,17.9 v25.9,18.4 | v17.1,30.4 17.1,33.5 v14.5,36.1 | v32.2,29.4 31.5,30.1 v26.5,30.1 v26.5,35.2 | v43,32.8 v45.1,30.7 | v23.4,40.1 23.4,38 23.9,37.5 30.1,37.5 30.5,37.1 30.5,35.5 30.1,35.1 26.6,35.1 | v30.7,46.6 22.2,46.6 20.3,48.5 19.7,48.5 19.6,48.4 19.6,48.3 19.9,48 v20.1,48 | v15.6,16.2 22.8,16.2 v23,16 | v19.8,43.58 v19.8,41.95
  Bottom 0.4: 30.6,14.2 v30.8,14.4 30.8,10.9 v32.3,9.4
  pour Top: 0,50 22.55,50 22.55,46.85 27.9,46.85 27.9,50 53,50 53,0 0,0
  pour Bottom: 0,50 22.55,50 22.55,46.85 27.9,46.85 27.9,50 53,50 53,0 0,0
LC_A2  (via drill 0.6)
  Top 0.2: U$4.3_HCI_CTS 24.3,41.07 24.3,42.85 24.5,43.05 v24.5,43.7 | v17,44.6 15.55,44.6 15.23,44.28 U$13.3_A2
  Bottom 0.2: v24.5,43.7 24.5,44.45 24.45,44.5 20.65,44.5 20.55,44.6 v17,44.6
LC_A3  (via drill 0.6)
  Top 0.2: U$4.4_HCI_RTS 25.55,42.38 v26.1,42.86 | v16,47.05 15.85,46.9 15.85,45.55 14.73,44.43 U$13.4_A3
  Bottom 0.2: v26.1,42.86 25.84,43.12 25.84,44.92 25.46,45.3 21.05,45.3 20.05,46.3 19.15,46.3 18.4,47.05 v16,47.05
LC_A4  (via drill 0.6)
  Top 0.2: U$4.5_HCI_RX 26.15,41.02 26.15,40.6 25.7,40.15 v25.3,40.15 | v14.7,46 14.23,45.53 U$13.5_A4
  Bottom 0.2: v25.3,40.15 25.35,44.5 25.35,44.7 25.15,44.9 20.85,44.9 19.85,45.9 18.9,45.9 18.8,46 v14.7,46
LC_A5  (via drill 0.6)
  Top 0.2: v14.2,47.2 13.73,46.73 U$13.6_A5 | U$4.6_HCI_TX 27.2,42.23 27.2,43.35 26.65,43.85 v26.65,43.95
  Bottom 0.2: v26.65,43.95 26.65,45.4 26.35,45.7 21.25,45.7 20.25,46.7 19.4,46.7 18.1,48 14.45,48 14.2,47.75 v14.2,47.2 14.2,47.5
N$1  (via drill 0.6)
  Top 0.3: U$1.3_RTS# 50.42,3.22 48.6,3.2 47.4,4.4 47.4,11 48.6,12.2 48.6,12.6 v48,12.8 | U$11.5 47.8,21.8 v48,21.6
  Bottom 0.3: v48,12.8 v48,21.6
N$2  (1 unrouted)
  Top 0.4: 27.2,9.4 26.4,9.4 25.5,8.5 U$20.2
  Top 0.406: 27.72,10.72 FERRITE.1 | 27.72,7.47 FUSE.2 27.65,10.62 C3.1 27.72,9.92 27.2,9.4
N$3
  Top 0.3: U$1.17_3V3OUT 44.74,9.14 45,9.4 45,12.6 43.8,13.8 43.8,15.2 C1.2
N$4
  Top 0.3: R11.2 18.34,19.27 R10.1 18.41,19.31 21.01,21.91 U$5.2_P6.5/A5
N$5
  Top 0.3: R2.1 37.45,14.95 36.1,16.3 35.54,16.3 MCP73831T-2.5_PROG
N$6
  Top 0.3: R3.1 40.06,3.34 38.8,4.6 38.8,5.25 38.8,5.57
  Top 0.406: U$7.1_R_A 38.78,5.25 38.8,5.25
N$7
  Top 0.3: MCP73831T-2.1_STAT 33.73,16.27 34.4,15.6 34.4,14 35.2,13.2 36.2,13.2 37.8,11.8 37.8,11.6 | 37.8,11.6 37.8,7.57 | 40.82,5.42 41.4,6 41.4,10.2 40,11.6 37.8,11.6
  Top 0.406: U$7.4_R_C 40.35,5.42 40.82,5.42 | U$7.2_G_A 37.8,7.57
N$8  (via drill 0.6)
  Top 0.2: U$13.7_A6 13.2,43.59 v13.2,48.55 | v30.45,42.75 29.65,41.95 U$4.8_SLOW_CLK_IN
  Bottom 0.2: v13.2,48.55 13.35,48.7 18.1,48.7 19.7,47.1 20.4,47.1 21.35,46.15 26.6,46.15 30,42.75 v30.45,42.75
N$9
  Top 0.406: R4.2 40.15,8.46 U$7.3_G_C
N$10
  Top 0.2: TPS622316.2_SW 28.41,15.21 28.01,15.21 27.9,15.1 26,15.1 25.9,15 25.9,14.5 25.5,14.1 23.3,14.1 21.8,15.6 21.8,17.21 SPULE.2
N$19
  Top 0.3: 29,17.8 28.4,17.18 TPS622316.5_EN | C6.2 28.97,17.83 29,17.8 | 29,17.8 29.2,17.6 30.6,17.6 31,17.2 30.99,15.99 30.6,15.6 29.12,15.6 TPS622316.3_VIN 28.91,14.91 28.5,14.5 26.8,14.5 25.8,13.5 24.7,13.5 24.5,13.3 24.5,10.6 24.1,10.2 23.12,10.2 U$12.5
N$25  (via drill 0.6)
  Top 0.2: v17.7,42.55 17.67,42.58 U$13.1_A1 | v23.35,43.2 23.35,44.1 23.7,44.45 23.7,44.5 24.27,44.5 U$4.16_NSHUTD
  Bottom 0.2: v17.7,42.55 18.25,42.55 18.55,42.25 18.55,41.25 18.65,41.15 21.15,41.15 22.65,42.65 23.05,42.65 23.35,42.95 v23.35,43.2
N$37
  Top 0.4: 12.2,3 11.6,3.6 11.6,6.14 C16.1 11.67,8.28 MOTOR.1 13.14,9.86 11.8,11.2 11.8,13.62 U$8.3_D
  Top 0.406: 12.2,3 U$9.A
N$40
  Top 0.3: R18.2 33.6,45.05 U$15.A
N$46
  Top 0.2: C15.2 9.99,35.61 11.31,34.29 U$2.7_C1_XM
N$47
  Top 0.2: U$2.8_SETC_XM 10.11,33.79 10,33.9 10.2,33.9 C14.1
N$48
  Top 0.2: U$2.9_SETP_XM 11.09,33.29 10.6,32.8 C14.2
N$50
  Top 0.3: R17.2 U$17.A
N$52
  Top 0.3: R16.2 U$18.A
N$53
  Top 0.3: R15.2 U$19.A
N$60
  Top 0.4: MICROUSB.1_VCC 30.3,5.5 29.7,6.1
  Top 0.406: FUSE.1 29.7,7.35 29.7,6.1
P1.1
  Top 0.3: U$1.5_RXD 49.68,4.52 49,5.2 49,10.6 50.6,12.2 50.6,14.8 48.2,17.2 48.2,19.2 46.8,20.6 43.2,20.6 41.9,21.9 34.3,21.9 33.5,21.1 29.7,21.1 29,21.8 29.01,21.81 U$5.18_P1.1/TA0.0
P1.2  (via drill 0.6)
  Top 0.3: U$1.1_TXD 47.48,1.92 45.8,3.6 45.8,14.3 v45.7,14.6 | v42,23 34.1,23 33.1,22 29.8,22 29.51,22.29 U$5.19_P1.2/TA0.1
  Bottom 0.3: v45.7,14.6 45.7,19.3 v42,23
P1.3  (via drill 0.6 pad 0.25)
  Top 0.2: U$13.13_B3 14.73,39.37 v15.8,38.3 | v29.2,25.5 30,24.7 U$5.20_P1.3/TA0.2
  Bottom 0.2: v15.8,38.3 18.7,35.4 21.5,35.4 22.6,34.3 22.6,29.8 27.1,25.3 29,25.3 v29.2,25.5
P1.4  (via drill 0.6 pad 0.25)
  Top 0.2: U$5.21_P1.4/TA0.3 30.51,24.89 30.1,25.3 30.1,26.4 v29.9,26.6 | v17,38.6 17,38.8 16.6,39.2 15.6,39.2 15.2,39.6 15.2,40.08 U$13.14_B2
  Bottom 0.2: v29.9,26.6 27.2,26.6 23.9,29.9 23.9,34.5 21.9,36.5 19.1,36.5 v17,38.6
P2.1
  Top 0.2: U$5.26_P2.1/TA1.0 35.33,24.93 36.8,26.4 38.2,26.4 40.8,29 46.75,29 R19.1 50.05,28.55 CAP.1
P4.0
  Top 0.2: U$5.43_P4.0/TB0.0 38.33,33.43 40.8,35.9 40.8,39.2 42.4,40.8 IMU_OUT.9_CS_G_NEXT
P4.1
  Top 0.2: IMU_OUT.10_CS_XM_NEXT 42.09,41.79 40.2,39.9 40.2,36 38.1,33.9 34.34,33.9 U$5.44_P4.1/TB0.1
P4.2  (via drill 0.6 pad 0.25)
  Top 0.2: U$5.45_P4.2/TB0.2 35.73,34.43 36.5,35.2 v36.5,36.3 | v43.8,35.1 44.4,35.7 46.73,35.7 IMU_OUT.4_CS_G
  Bottom 0.2: v36.5,36.3 37.4,37.2 41.7,37.2 v43.8,35.1
P4.3  (via drill 0.6 pad 0.25)
  Top 0.2: U$5.46_P4.3/TB0.3 35.13,34.93 35.5,35.3 35.5,37 v36.5,38 | v43.8,36.7 46.73,36.7 IMU_OUT.5_CS_XM
  Bottom 0.2: v36.5,38 42.5,38 v43.8,36.7
P6.0  (via drill 0.6)
  Top 0.3: U$1.2_DTR# 48.03,2.57 46.6,4 46.6,13.4 v47,13.8 | v41.2,24.4 v36.8,24.4 | v24.6,26.4 24.57,26.43 U$5.97_P6.0/A0
  Bottom 0.3: v47,13.8 47,19.8 42.4,24.4 v41.2,24.4 | v24.6,26.4 26.6,24.4 v36.8,24.4
P6.3  (via drill 0.6 pad 0.25)
  Top 0.2: U$8.1_G 14.15,18.88 R13.1 15.39,19.01 v15.6,18.8 | v16.8,24.6 17,24.8 18.58,24.8 U$5.100_P6.3/A3
  Bottom 0.2: v15.6,18.8 15.6,20.8 17,22.2 17,24.4 v16.8,24.6
P7.3
  Top 0.2: U$5.56_P7.3/TA1.2 30,37.5 30.6,36.9 32.6,36.9 33.7,38 34.8,38 36.7,39.9 36.7,41 38.8,43.1 R15.1
P8.0
  Top 0.2: U$5.57_P8.0/TA0.0 29.5,39.5 29.8,39.8 31.1,39.8 33.9,42.6 36.2,42.6 37.1,43.5 R16.1
P8.1
  Top 0.2: U$5.58_P8.1/TA0.1 29,39.6 29.6,40.2 30.8,40.2 33.6,43 34.7,43 35.35,43.65 R17.1
P8.2  (via drill 0.6 pad 0.25)  (1 unrouted)
  Top 0.2: 28.51,36.99 v29.2,36.3 | v17.7,41.2 17.64,41.1 U$13.16_B1 | R9.2 9.63,45.13 10.2,45.7 v12.4,45.7
  Bottom 0.2: v29.2,36.3 23.6,36.3 22.8,37.1 20.3,37.1 18.1,39.3 18.1,40.8 v17.7,41.2 17.6,41.3 14.9,41.3 13.5,42.7 13.5,44.6 v12.4,45.7
P8.3  (1 unrouted)
  Top 0.2: U$5.60_P8.3/TA0.3 28,39.6 28.2,39.8 28.6,39.8 29.4,40.6 30.5,40.6 32.5,42.6 32.5,43.3 32.85,43.65 R18.1
P10.7  (via drill 0.6 pad 0.25)
  Top 0.2: U$5.83_P10.7 20.23,33.43 v20.6,33.8 | v11.2,43.7 11.38,43.7 U$13.8_OE
  Top 0.3: R8.1 12.37,42.44 U$13.8_OE
  Bottom 0.2: v20.6,33.8 20.4,34 17.7,34 14.8,36.9 12.8,36.9 11.8,37.9 11.8,43.5 11.3,44 11.1,44 11,43.9 v11.2,43.7
P11.1
  Top 0.2: U$2.20_CS_XM 16.29,32.29 16.4,32.4 18.68,32.4 U$5.85_P11.1/MCLK
P11.2
  Top 0.2: U$2.19_CS_G 16.49,31.79 16.6,31.9 18.68,31.9 U$5.86_P11.2/SMCLK
RST#  (via drill 0.6)
  Top 0.3: U$16.11_RST 4.33,8.73 5.4,9.8 7.6,9.8 8.6,10.8 8.6,14.8 11.2,17.4 11.2,20.9 | 11.2,20.9 11.2,21 17.13,26.93 U$5.96_RST#/NMI/SBWTDIO 20.33,26.93 21.2,27.8 21.7,27.8 v21.8,27.7 | 11.49,21.19 11.2,20.9 | 23,21.4 22.5,20.9 v21.9,20.9
  Top 0.406: C17.2 11.49,21.19 | 23,21.4 R14.2
  Bottom 0.3: v21.9,20.9 21.8,21 v21.8,27.7
TCK
  Top 0.3: U$16.7_TCK 4.33,13.73 5.6,15 7.6,15 10.2,17.6 10.2,21.8 15.83,27.43 U$5.95_PJ.3/TCK
TDI
  Top 0.3: U$16.3_TDI/VPP 5.65,20.07 5.65,21.65 12.43,28.43 U$5.93_PK.1/TDI/TCLK
TDO
  Top 0.3: U$16.1_TDO/TDI 11.97,28.93 U$5.92_PJ.0/TDO
TEST  (via drill 0.6)
  Top 0.3: U$16.8_TEST/VPP 5.6,12.4 3.6,12.4 3,13 3,21.8 10.63,29.43 U$5.91_TEST/SBWTCK v25.51,29.43 | v41.52,26.1 43.32,24.3 U$11.6
  Bottom 0.3: v25.51,29.43 27.51,27.43 40.19,27.43 v41.52,26.1
TMS
  Top 0.3: U$16.5_TMS 4.33,16.33 5.6,17.6 7.6,17.6 9.4,19.4 9.4,22.8 14.53,27.93 U$5.94_PJ.2/TMS
UCA2RXD
  Top 0.2: U$5.73_P9.5/UCA2RXD/UCA2SOMI 21.51,37.91 21,37.4 17.8,37.4 17.4,37 14.8,37 13.73,38.07 U$13.11_B5
UCA2TXD
  Top 0.2: U$13.12_B4 14.23,38.27 15.1,37.4 17.2,37.4 19.6,39.8 21.9,39.8 22,39.7 U$5.72_P9.4/UCA2TXD/UCA2SIMO
UCB0CLK  (1 unrouted)
  Top 0.2: U$5.36_P3.3/UCB0CLK/UCA0STE 50.63,29.93 51.4,30.7 51.4,38.5 50.1,39.8 IMU_OUT.8_SCL_NEXT
UCB0SIMO  (via drill 0.6 pad 0.25)
  Top 0.2: IMU_OUT.11_SDI_NEXT 41.79,42.79 39,40 v39,36.2 | v38.8,28.6 38.3,28.1 36.3,28.1 35.5,28.9 34.34,28.9 U$5.34_P3.1/USB0SIMO/UCB0SDA
  Bottom 0.2: v39,36.2 39,28.8 v38.8,28.6
UCB0SOMI  (via drill 0.6 pad 0.25)
  Top 0.2: IMU_OUT.12_SDO_NEXT 43.71,43.79 43.7,43.8 41.4,43.8 37.9,40.3 v37.9,35 | v37.3,28.9 36.8,29.4 34.34,29.4 U$5.35_P3.2/UCB0SOMI/UCB0SCL
  Bottom 0.2: v37.9,35 37.9,29.5 v37.3,28.9
UCB1CLK  (via drill 0.6 pad 0.25)
  Top 0.2: IMU_OUT.3_SCL 48.99,34.79 v49.7,35.5 | U$5.52_P5.5/UCB1CLK/UCA1STE 32,39.94 33.2,41.2 v33.6,41.2
  Bottom 0.2: v49.7,35.5 49.7,38.9 47.4,41.2 v33.6,41.2
UCB1SIMO
  Top 0.2: U$5.42_P3.7/UCB1SIMO/UCB1SDA 38.73,32.93 41.7,35.9 41.7,37.4 42.1,37.8 IMU_OUT.6_SDI
UCB1SOMI  (via drill 0.6 pad 0.25)
  Top 0.2: IMU_OUT.7_SDO 42.51,38.79 v42.2,39.1 | v33.9,39.1 32.88,39.1 U$5.51_P5.4/UCB1SOMI/UCB1SCL
  Bottom 0.2: v42.2,39.1 v33.9,39.1
UCB3CLK
  Top 0.2: U$2.21_SCL/SPC 16.09,32.79 16.5,33.2 16.5,34.8 17.1,35.4 18.68,35.4 U$5.79_P10.3/UCB3CLK/UCA3STE
UCB3SIMO
  Top 0.2: U$5.77_P10.1/UCB3SIMO/UCB3SDA 16.13,36.43 15.4,35.7 15.4,34.37 U$2.24_SDA
UCB3SOMI
  Top 0.2: U$5.78_P10.2/UCB3SOMI/UCB3SCL 18.68,35.9 16.7,35.9 16,35.2 16,34 15.79,33.79 U$2.23_SDO_XM/SA0_XM U$2.22_SDO_G/SA0_G
USBCON  (via drill 0.6)
  Top 0.2: R6.2 41.56,14.73 R7.1 42.17,17.63 v42.6,16.6 | v31,25.6 U$5.22_P1.5/TA0.4
  Bottom 0.2: v42.6,16.6 42.6,20.3 40.2,22.8 40.2,25.6 39.2,26.6 32,26.6 v31,25.6
USBDM  (via drill 0.6)
  Top 0.3: MICROUSB.2_DATA- 30.95,6.55 v31,6.6 | v41,12.8 41,12 42,10.8 42,10.2 42.4,9.8 43.53,9.8 U$1.16_USBDM
  Bottom 0.3: v31,6.6 34.6,10.2 36.8,10.2 39.6,13 40.8,13 v41,12.8
USBDP  (via drill 0.6)
  Top 0.3: MICROUSB.3_DATA+ 31.6,5.6 31.9,5.9 34.4,5.9 v34.9,6.4 | v43.1,11.8 43.34,11.56 U$1.15_USBDP
  Bottom 0.3: v34.9,6.4 35.5,7 36.5,7 37.7,8.2 37.7,10 39.5,11.8 v43.1,11.8
VCC1,8  (via drill 0.6, 0.6 pad 0.25)
  Top 0.2: U$13.2_VCCA 18.14,43.55 19,42.75 | 19,42.75 v19,40.35 | 30.3,43.7 29.22,43.7 U$4.10_MLDO_OUT 27.85,43.75 27.4,44.2 27.4,44.6 27.2,44.75 26.55,44.75 26.15,45.1 26.15,46.42 U$4.15_MLDO_IN | U$4.22_VDD_IO 20.52,42.75 19,42.75
  Top 0.254: 38.35,20.14 38.89,19.6 v40.2,19.6
  Top 0.3: LP5951MF-1.8.5_OUT 38.01,20.1 C8.2 38.35,20.14 | v38.8,25.4 41.4,28 v44.8,28 | v30.7,44.1 30.3,43.7
  Bottom 0.2: v19,40.35 22,40.35 22.6,41 23.8,41 24.4,40.4 24.4,39.7 25,39.1 31.5,39.1 32.5,40.1
  Bottom 0.3: v38.8,25.4 39.4,24.8 39.4,22.6 40.8,21.2 40.8,20.2 v40.2,19.6 | v44.8,28 46.6,29.8 46.6,31.3 45.1,32.8 45.1,38.5 43.5,40.1 32.5,40.1 31.6,41 31.6,43.3 30.8,44.1 v30.7,44.1
VCC2,7  (via drill 0.6, 0.6 pad 0.25)
  Top 0.2: U$2.10_DEN_G 11.29,32.79 10.5,32 8.18,32 C13.1 | U$4.11_CL1.5_LDO_IN 28.22,44.6 29.5,44.6
  Top 0.254: U$2.16_VDD U$2.15_VDD 13.22,31.98 | 12.03,32.8 12.02,32.79 U$2.10_DEN_G
  Top 0.3: TPS622316.6_FB 27.71,16.89 27.4,17.2 | 27.4,17.2 24.65,17.2 C2.2 | 25.21,19.67 C11.1 | SPULE.1 23.58,18.98 v23.6,19 | 24.4,17.4 24.45,17.4 C2.2 | LP5951MF-1.8.3_EN 32.36,18.84 31.8,19.4 | 31.8,19.4 32.4,20.2 32.91,20.2 LP5951MF-1.8.1_IN 33.23,20.2 34,20.2 35.04,21.24 39.99,21.24 40.33,20.9 40.7,20.9 45.8,15.8 48.6,15.8 49.8,14.6 49.8,12.4 48.2,10.8 48.2,4.8 49.13,3.87 U$1.4_VCCIO | 31.8,19.4 31.8,19.8 31.4,20.2 28,20.2 | 28,20.2 27.4,19.6 27.4,17.2 | 24.26,19 C11.1 | v23.6,19 24.26,19 | 24.26,19 24.26,17.39 C2.2 | U$2.16_VDD U$2.17_VDD U$2.18_VDD_IO 14.83,31.2 16.6,31.2 16.83,31.43 U$5.87_DVCC4 27.87,31.43 | 13.22,31.98 12.4,32.8 | 12.4,32.8 12.03,32.8 | C12.2 5.77,30.97 | 5.77,30.97 C13.1 | U$5.11_AVCC 25.51,21.11 25.1,20.7 25.1,19.84 C11.1 | 27.87,31.43 28.4,30.9 | 28.4,30.9 28.01,30.51 U$5.16_DVCC1 28.01,20.21 28,20.2 | 27.87,31.43 27.87,34.13 | 27.87,34.13 25.97,34.13 25.3,34.8 25.3,37 26.01,37.71 U$5.64_DVCC2 | 27.87,34.13 27.7,34.3 27.7,37 27.01,37.69 U$5.62_VCORE 27.01,39.51 27.29,39.79 27.53,39.79 28.04,40.3 28.4,40.3 28.7,40.6 28.7,40.9 28.9,41.1 29.6,41.1 29.9,41.4 30.6,41.4 31.9,42.7 31.9,44.8 31.3,45.4 30.3,45.4 29.5,44.6 | 5.77,30.97 7.22,30.97 R1.1 | 41.5,30.93 U$5.38_DVCC3 28.43,30.93 28.4,30.9 | 41.5,30.93 43.23,30.93 45.1,32.8 IMU_OUT.1_VCC | 12.4,32.8 13.3,32.8 v14,33.5 | v17.2,40 15.84,40 U$13.15_VCCB | C10.1 41.39,31.04 41.5,30.93 | v23.6,19 23.6,19.8 23.61,19.8 R14.1
  Bottom 0.3: v14,33.5 14,34.7 10,38.7 10,44.1 10.8,44.9 11.8,44.9 12.8,43.9 12.8,41.2 13.8,40.2 17,40.2 v17.2,40 | U$16.4_VCC_TARGET 6.87,18.73 8.4,17.2 21.8,17.2 v23.6,19
VCCBAT  (1 unrouted)
  Top 0.3: 31.14,13.2 31.37,13.2 C5.1 | R11.1 17.04,16.24 14.8,14 14.8,13 14,12.2
  Top 0.4: 33,14.48 MCP73831T-2.3_VBAT 31.14,13.2 30.5,13.2 29.9,13.8 27.2,13.8 26.1,12.7 25.4,12.7 25.3,12.6 25.3,10.3 24.6,9.6 24.6,7.7 24.2,7.3 | 16.74,2.94 BAT.2 20.75,4.35 21.8,5.4 23.4,5.4 24.4,6.4 24.4,7.1 24.2,7.3 | 13.37,6.57 14.8,8 14.8,11.4 14,12.2 13.23,12.2 | U$12.6 24.2,7.3
  Top 0.406: 13.37,6.57 13.47,6.47 | 13.47,6.47 16.74,3.2 16.74,2.94 U$9.C | C16.2 13.47,6.47
VCCUSB  (via drill 0.6)
  Top 0.2: v38.4,13.2 39.8,14.6 40.25,14.6 R6.1
  Top 0.3: C7.1 36.69,9.51 37,9.2 37,3.2 37.6,2.6 38.73,2.6 R3.2 38.8,2.59 38.8,2 39,1.8 41.2,1.8 42,2.6 42,6.8 42.39,7.19 U$1.20_VCC U$1.19_RESET#
  Top 0.4: 35.88,9.66 35.88,10.68 v36.6,11.4 | v38.4,13.2 38,13.2 36.8,14.4 35.68,14.4 MCP73831T-2.4_VDD | C7.1 34.46,9.51 C4.2 33.14,9.86 32.7,10.3 31.44,10.3 FERRITE.2
  Top 0.406: 35.88,9.66 C7.1
  Bottom 0.2: 36.4,11.6 v36.6,11.4
  Bottom 0.4: v36.6,11.4 v38.4,13.2